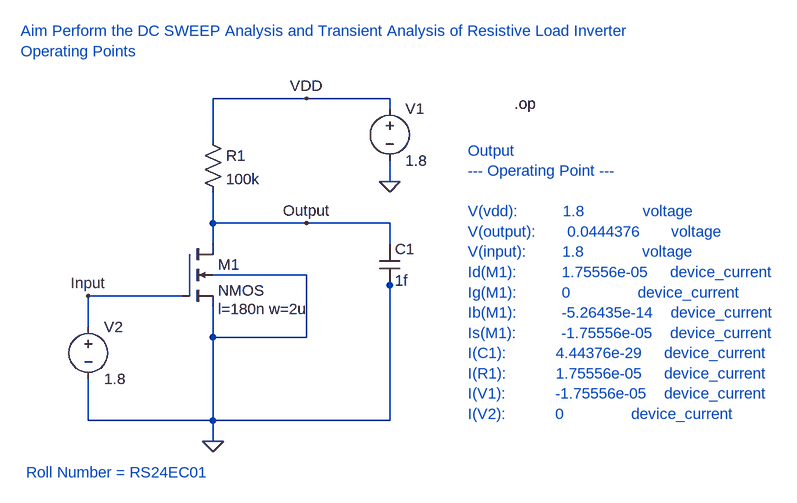
[diagram p0: schematic Exp1 VTC_Resistive_Inverter_Operating_Pointat1.8.asc]
Exp1 VTC_Resistive_Inverter_Operating_Pointat1.8.asc, the LTspice schematic file:
Version 4
SHEET 1 1576 680
WIRE 448 -112 304 -112
WIRE 576 -112 448 -112
WIRE 576 -96 576 -112
WIRE 304 -48 304 -112
WIRE 576 16 576 -16
WIRE 304 80 304 32
WIRE 448 80 304 80
WIRE 576 80 448 80
WIRE 304 112 304 80
WIRE 576 112 576 80
WIRE 448 160 304 160
WIRE 576 176 576 160
WIRE 256 192 112 192
WIRE 112 240 112 192
WIRE 304 256 304 208
WIRE 448 256 448 160
WIRE 448 256 304 256
WIRE 112 384 112 320
WIRE 304 384 304 256
WIRE 304 384 112 384
WIRE 576 384 576 176
WIRE 576 384 304 384
WIRE 304 416 304 384
FLAG 576 16 0
FLAG 304 416 0
FLAG 112 192 Input
FLAG 448 80 Output
FLAG 448 -112 VDD
SYMBOL res 288 -64 R0
SYMATTR InstName R1
SYMATTR Value 100k
SYMBOL cap 560 112 R0
SYMATTR InstName C1
SYMATTR Value 1f
SYMBOL voltage 576 -112 R0
WINDOW 123 0 0 Left 0
WINDOW 39 0 0 Left 0
SYMATTR InstName V1
SYMATTR Value 1.8
SYMBOL voltage 112 224 R0
WINDOW 123 0 0 Left 0
WINDOW 39 0 0 Left 0
SYMATTR InstName V2
SYMATTR Value 1.8
SYMBOL nmos4 256 112 R0
WINDOW 123 56 100 Left 2
SYMATTR Value2 l=180n w=2u
SYMATTR InstName M1
TEXT 8 -216 Left 2 ;Aim Perform the DC SWEEP Analysis and Transient Analysis of Resistive Load Inverter\nOperating Points
TEXT 16 464 Left 2 ;Roll Number = RS24EC01
TEXT 768 -104 Left 2 !.op
TEXT 696 -32 Left 2 ;Output\n--- Operating Point ---\n \nV(vdd):          1.8             voltage\nV(output):       0.0444376       voltage\nV(input):        1.8             voltage\nId(M1):          1.75556e-05     device_current\nIg(M1):          0               device_current\nIb(M1):          -5.26435e-14    device_current\nIs(M1):          -1.75556e-05    device_current\nI(C1):           4.44376e-29     device_current\nI(R1):           1.75556e-05     device_current\nI(V1):           -1.75556e-05    device_current\nI(V2):           0               device_current

The netlist it stands for:
* Exp1 VTC_Resistive_Inverter_Operating_Pointat1.8.asc
R1 VDD Output 100k
C1 Output 0 1f
V1 VDD 0 1.8
V2 Input 0 1.8
M1 Output Input 0 0 NMOS l=180n w=2u
.model NMOS NMOS
.model PMOS PMOS
.lib standard.mos
* Aim Perform the DC SWEEP Analysis and Transient Analysis of Resistive Load Inverter
* Operating Points
* Roll Number = RS24EC01
.op
* Output
* --- Operating Point ---
* V(vdd):          1.8             voltage
* V(output):       0.0444376       voltage
* V(input):        1.8             voltage
* Id(M1):          1.75556e-05     device_current
* Ig(M1):          0               device_current
* Ib(M1):          -5.26435e-14    device_current
* Is(M1):          -1.75556e-05    device_current
* I(C1):           4.44376e-29     device_current
* I(R1):           1.75556e-05     device_current
* I(V1):           -1.75556e-05    device_current
* I(V2):           0               device_current
.backanno
.end

* Results of the author's LTspice run, read from the files saved beside the schematic
* Operating Point:
*   V(vdd) = 1.8 V
*   V(output) = 44.44 mV
*   V(input) = 1.8 V
*   Id(M1) = 17.56 µA
*   Ig(M1) = 0 A
*   Ib(M1) = -52.64 fA
*   Is(M1) = -17.56 µA
*   I(C1) = 0 A
*   I(R1) = 17.56 µA
*   I(V1) = -17.56 µA
*   I(V2) = 0 A
* From the log:
*   Semiconductor Device Operating Points:
*                           --- MOSFET Transistors ---
*   Name:          m1
*   Model:        nmos
*   Id:          1.76e-05
*   Vgs:         1.80e+00
*   Vds:         4.44e-02
*   Vbs:         0.00e+00
*   Vth:         0.00e+00
*   Vdsat:       1.80e+00
*   Gm:          9.88e-06
*   Gds:         3.90e-04
*   Gmb:         0.00e+00
*   Cbd:         0.00e+00
*   Cbs:         0.00e+00
*   Cgsov:       0.00e+00
*   Cgdov:       0.00e+00
*   Cgbov:       0.00e+00
*   Cgs:         0.00e+00
*   Cgd:         0.00e+00
*   Cgb:         0.00e+00